# EAGLE design Shield_try1 (EAGLE 9.5.1)
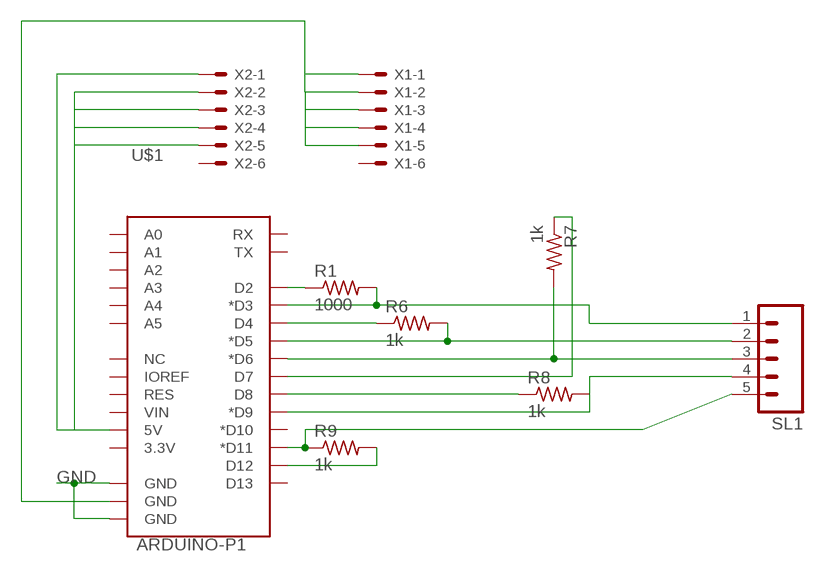
[diagram p0: schematic, sheet 1]

## Parts
R1  1000  R-US_R0805  [R0805]
R6  1k  R-US_R0805  [R0805]
R7  1k  R-US_R0805  [R0805]
R8  1k  R-US_R0805  [R0805]
R9  1k  R-US_R0805  [R0805]
SL1  M05  [05P]
U$1  ARDUINO-P1  [ARDUINO-P1]
X1  22-23-2061  [22-23-2061]
X2  22-23-2061  [22-23-2061]

## Nets
GND: U$1.GND@0(GND) U$1.GND@1(GND) U$1.GND@2(GND) X1.1 X1.2 X1.3 X1.4 X1.5
N$1: R1.2 SL1.1 U$1.D3(*D3)
N$2: R7.2 SL1.3 U$1.D6(*D6)
N$3: R6.1 U$1.D4
N$4: R6.2 SL1.2 U$1.D5(*D5)
N$5: R7.1 U$1.D7
N$7: R8.1 U$1.D8
N$8: R8.2 SL1.4 U$1.D9(*D9)
N$9: R9.1 SL1.5 U$1.D11(*D11)
N$10: R9.2 U$1.D12
N$11: R1.1 U$1.D2
N$16: U$1.5V X2.1 X2.2 X2.3 X2.4 X2.5
Unconnected: U$1.3.3V U$1.A0 U$1.A1 U$1.A2 U$1.A3 U$1.A4 U$1.A5 U$1.D10(*D10) U$1.D13 U$1.IOREF U$1.NC U$1.RES U$1.RX U$1.TX U$1.VIN X1.6 X2.6

## Library data of the parts
R1 R6-R9 = rcl:R-US_: RESISTOR, American symbol; SPICEPREFIX: R
SL1 = con-amp-quick:M05: AMP QUICK CONNECTOR; OC_FARNELL: unknown; OC_NEWARK: unknown
U$1 = Shield_try1:ARDUINO-P1: ARDUINO SHIELD BOARD
X1 X2 = con-molex:22-23-2061: .100" (2.54mm) Center Header - 6 Pin; MF: MOLEX; MPN: 22-23-2061; OC_FARNELL: 1462922; OC_NEWARK: 27C1933

## Board
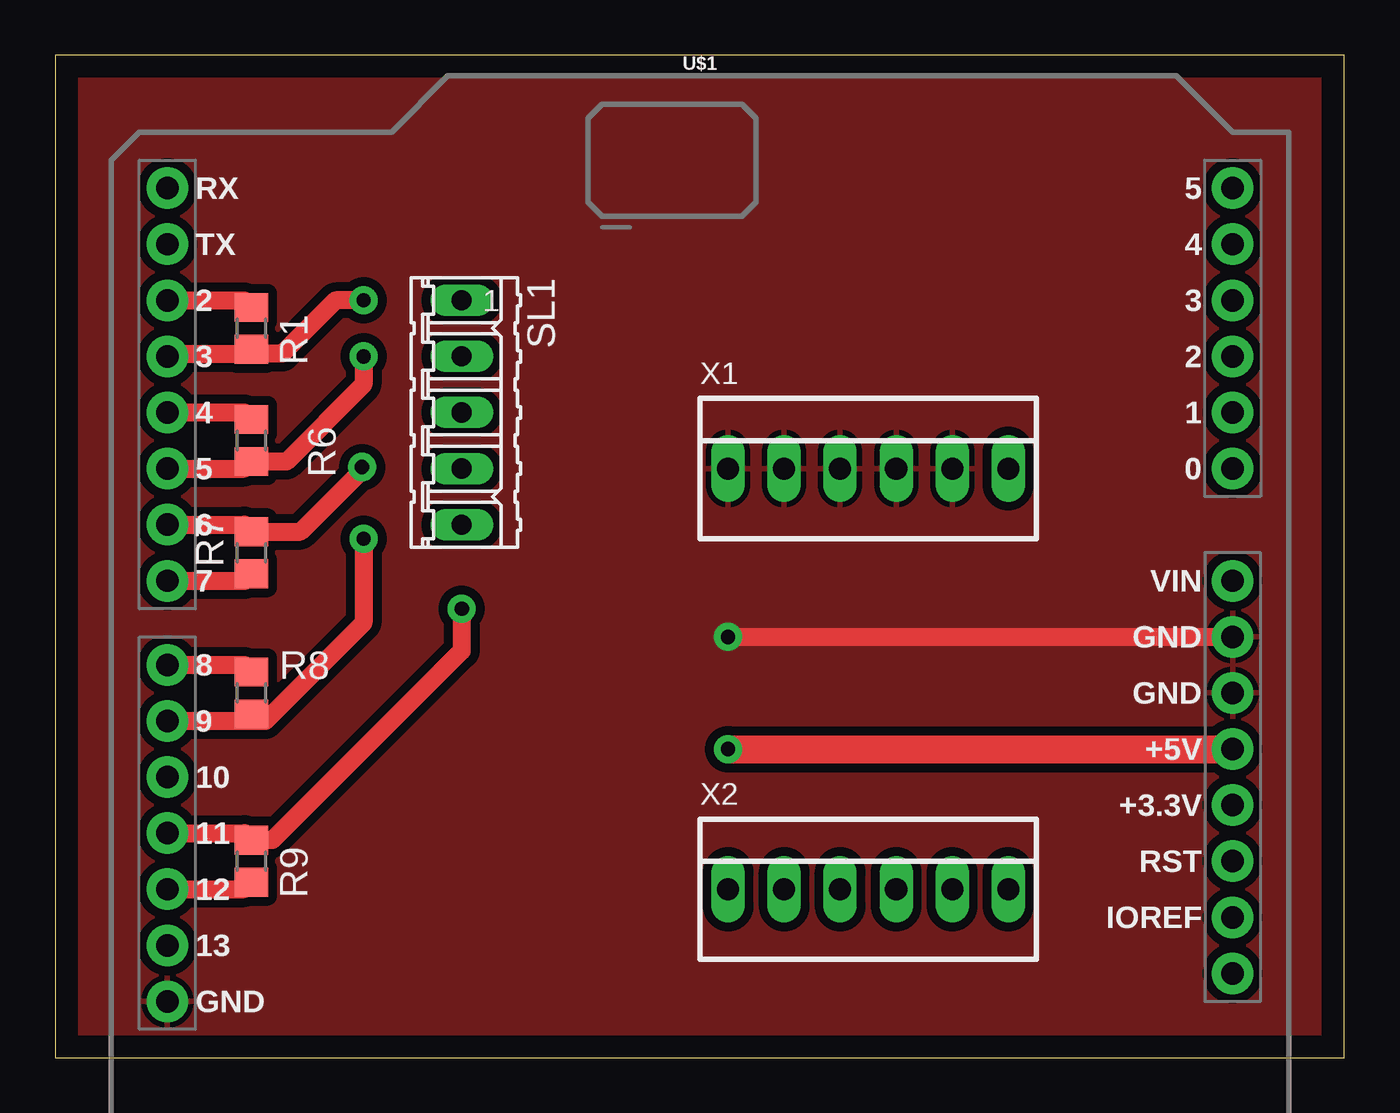
[diagram p1: board, top side]
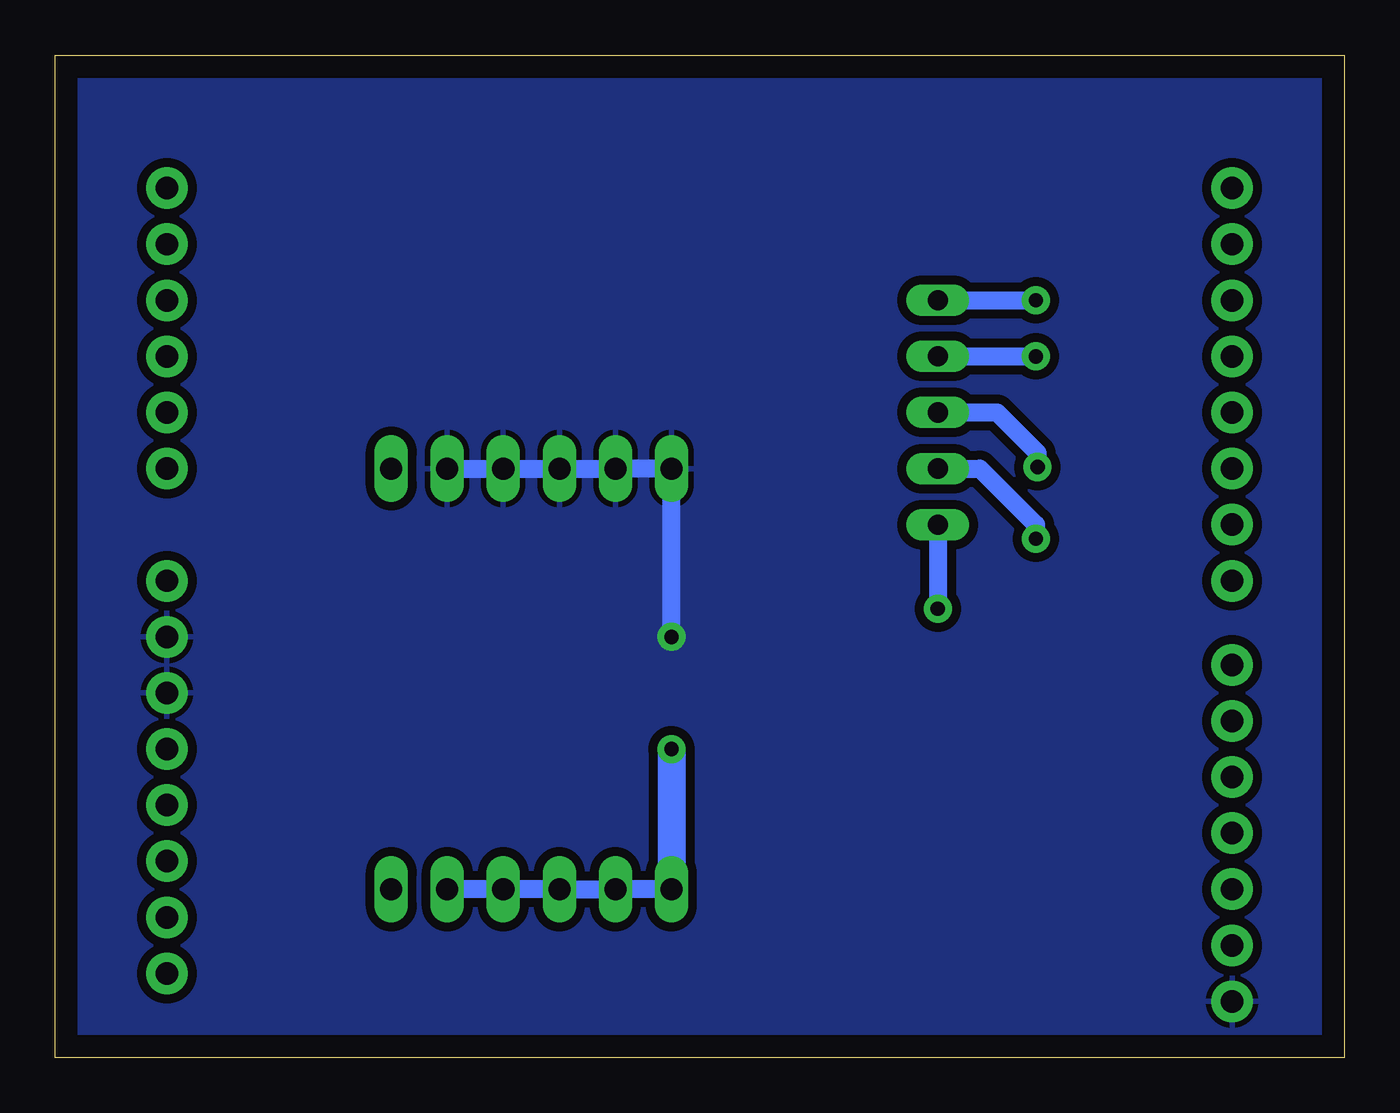
[diagram p2: board, bottom side, seen from below]

Size 58.4 x 45.39 mm. Coordinates in mm from the lower left corner, seen from the top.
Outline: 0,0 58.4,0 58.4,45.39 0,45.39 0,0
Copper layers (1*16): Top 0.035mm / dielectric 1.5mm / Bottom 0.035mm
Design rules "default *": minimum track width 6mil, minimum drill 0.35mm, track to track 16mil, track to pad 16mil, pad to pad 16mil, via to via 16mil, smd to smd 6mil, copper to edge 40mil, drill to drill 6mil, minimum pad ring 10mil, minimum via ring 8mil, stop-mask expansion 4mil, vias tented up to drill 0mil, thermal gap 10mil

### Footprints (pad centres in the part's own frame; a part is rotated, then mirrored left to right if it is on the bottom)
R0805 = smd 1.3 x 1.5: 1 -0.95,0; 2 0.95,0
05P = drill 0.914 long: 1 -5.08,0; 2 -2.54,0; 3 0,0; 4 2.54,0; 5 5.08,0
ARDUINO-P1 = drill 1.016 pad 1.88: 3.3V 24.13,-2.54; 5V 24.13,0; A0 24.13,12.7; A1 24.13,15.24; A2 24.13,17.78; A3 24.13,20.32; A4 24.13,22.86; A5 24.13,25.4; D2 -24.13,20.32; D3 -24.13,17.78; D4 -24.13,15.24; D5 -24.13,12.7; D6 -24.13,10.16; D7 -24.13,7.62; D8 -24.13,3.81; D9 -24.13,1.27; D10 -24.13,-1.27; D11 -24.13,-3.81; D12 -24.13,-6.35; D13 -24.13,-8.89; GND@0 24.13,2.54; GND@1 24.13,5.08; GND@2 -24.13,-11.43; IOREF 24.13,-7.62; NC 24.13,-10.16; RES 24.13,-5.08; RX -24.13,25.4; TX -24.13,22.86; VIN 24.13,7.62
22-23-2061 = drill 1 long: 1 -6.35,0; 2 -3.81,0; 3 -1.27,0; 4 1.27,0; 5 3.81,0; 6 6.35,0

### Placement (x,y rotation side)
R1  8.89,33.02 270 top
R6  8.89,27.94 270 top
R7  8.89,22.86 90 top
R8  8.89,16.51 270 top
R9  8.89,8.89 270 top
SL1  18.42,29.21 270 top
U$1  29.21,13.97 0 top
X1  36.83,26.67 0 top
X2  36.83,7.62 0 top

### Tracks (layer width: path | path; a pad name or v marks a point on that pad's centre or on a via)
GND  (via drill 0.65 pad 1.27)
  Top 0.813: v30.48,19.05 U$1.GND@1
  Bottom 0.813: v30.48,19.05 X1.1 X1.2 X1.3 X1.4 X1.5
  pour Top: -0.64,45.72 59.69,45.72 59.69,-1.27 -0.64,-1.27
  pour Bottom: -0.64,46.36 60.33,46.36 60.33,-1.9 -1.27,-1.9 -1.27,46.36
N$1  (via drill 0.65 pad 1.27)
  Top 0.813: 8.69,31.87 R1.2 | U$1.D3 5.2,31.87 8.69,31.87 | v13.97,34.29 12.7,34.29 10.28,31.87 8.69,31.87
  Bottom 0.813: SL1.1 v13.97,34.29
N$2  (via drill 0.65 pad 1.27)
  Top 0.813: U$1.D6 8.57,24.13 R7.2 11.11,23.81 13.9,26.6 v13.9,26.74
  Bottom 0.813: SL1.3 15.73,29.21 13.9,27.38 v13.9,26.74
N$3
  Top 0.813: U$1.D4 8.57,29.21 R6.1
N$4  (via drill 0.65 pad 1.27)
  Top 0.813: U$1.D5 8.57,26.67 R6.2 10.48,26.99 13.97,30.48 v13.97,31.75
  Bottom 0.813: SL1.2 v13.97,31.75
N$5
  Top 0.813: U$1.D7 8.57,21.59 R7.1
N$7
  Top 0.813: U$1.D8 8.57,17.78 R8.1
N$8  (via drill 0.65 pad 1.27)
  Top 0.813: U$1.D9 9.53,15.24 9.5,15.26 9.53,15.28 | R8.2 8.89,15.28 9.53,15.28 | 9.53,15.28 9.56,15.28 13.97,19.68 v13.97,23.5
  Bottom 0.813: v13.97,23.5 13.97,24.13 16.51,26.67 SL1.4
N$9  (via drill 0.65 pad 1.27)
  Top 0.813: U$1.D11 8.57,10.16 R9.1 9.84,9.84 18.42,18.41 v18.42,20.32
  Bottom 0.813: SL1.5 v18.42,20.32
N$10
  Top 0.813: R9.2 8.57,7.62 U$1.D12
N$11
  Top 0.813: R1.1 8.57,34.29 U$1.D2
N$16  (via drill 0.65 pad 1.27)
  Top 1.27: v30.48,13.97 U$1.5V
  Bottom 0.813: X2.1 X2.2 X2.3 X2.4 X2.5
  Bottom 1.27: v30.48,13.97 X2.1